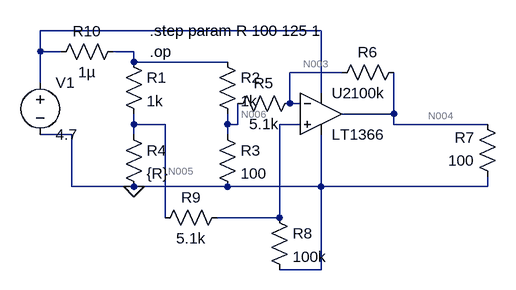
[diagram p0: schematic dorotki.asc]
dorotki.asc, the LTspice schematic file:
Version 4
SHEET 1 880 680
WIRE 368 48 -64 48
WIRE -64 80 -64 48
WIRE -32 80 -64 80
WIRE 80 80 48 80
WIRE 80 96 80 80
WIRE 224 96 80 96
WIRE 400 112 320 112
WIRE -64 128 -64 80
WIRE 368 144 368 48
WIRE 320 160 320 112
WIRE 336 160 320 160
WIRE 480 176 480 112
WIRE 480 176 400 176
WIRE 80 192 80 176
WIRE 128 192 80 192
WIRE 224 192 224 176
WIRE 240 192 240 160
WIRE 240 192 224 192
WIRE 336 192 304 192
WIRE 480 192 480 176
WIRE 624 192 480 192
WIRE -16 208 -64 208
WIRE 80 208 80 192
WIRE 224 208 224 192
WIRE -16 288 -16 208
WIRE 80 288 -16 288
WIRE 224 288 80 288
WIRE 368 288 368 208
WIRE 368 288 224 288
WIRE 624 288 624 272
WIRE 624 288 368 288
WIRE 128 336 128 192
WIRE 304 336 304 192
WIRE 304 336 208 336
WIRE 368 416 368 288
WIRE 368 416 304 416
FLAG 80 288 0
SYMBOL res 64 80 R0
SYMATTR InstName R1
SYMATTR Value 1k
SYMBOL res 208 80 R0
SYMATTR InstName R2
SYMATTR Value 1k
SYMBOL res 208 192 R0
SYMATTR InstName R3
SYMATTR Value 100
SYMBOL res 64 192 R0
SYMATTR InstName R4
SYMATTR Value {R}
SYMBOL voltage -64 112 R0
WINDOW 123 0 0 Left 2
WINDOW 39 0 0 Left 2
SYMATTR InstName V1
SYMATTR Value 4.7
SYMBOL res 336 144 R90
WINDOW 0 0 56 VBottom 2
WINDOW 3 32 56 VTop 2
SYMATTR InstName R5
SYMATTR Value 5.1k
SYMBOL res 496 96 R90
WINDOW 0 0 56 VBottom 2
WINDOW 3 32 56 VTop 2
SYMATTR InstName R6
SYMATTR Value 100k
SYMBOL res 640 288 R180
WINDOW 0 36 76 Left 2
WINDOW 3 36 40 Left 2
SYMATTR InstName R7
SYMATTR Value 100
SYMBOL res 288 320 R0
SYMATTR InstName R8
SYMATTR Value 100k
SYMBOL res 224 320 R90
WINDOW 0 0 56 VBottom 2
WINDOW 3 32 56 VTop 2
SYMATTR InstName R9
SYMATTR Value 5.1k
SYMBOL Opamps\\LT1366 368 112 R0
SYMATTR InstName U2
SYMBOL res 64 64 R90
WINDOW 0 0 56 VBottom 2
WINDOW 3 32 56 VTop 2
SYMATTR InstName R10
SYMATTR Value 1µ
TEXT 104 48 Left 2 !.step param R 100 125 1
TEXT 104 80 Left 2 !.op

The netlist it stands for:
* dorotki.asc
R1 N002 N005 1k
R2 N002 N006 1k
R3 N006 0 100
R4 N005 0 {R}
V1 N001 0 4.7
R5 N003 N006 5.1k
R6 N004 N003 100k
R7 0 N004 100
R8 N007 0 100k
R9 N007 N005 5.1k
XU2 N007 N003 N001 0 N004 LT1366  ; pins In+ In- V+ V- OUT
R10 N002 N001 1µ
.step param R 100 125 1
.op
.lib LTC.lib
.backanno
.end

* Results of the author's LTspice run, read from the files saved beside the schematic
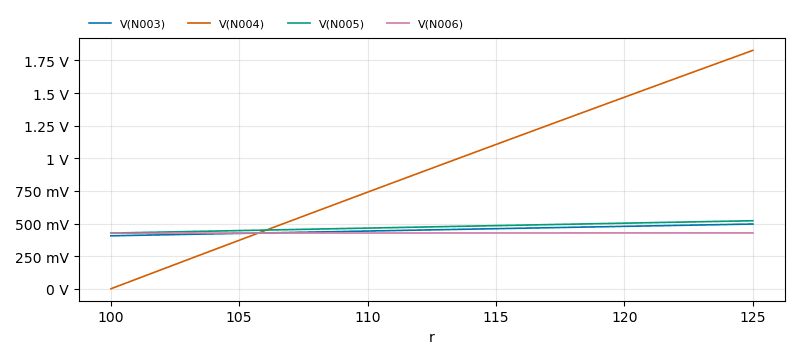
[diagram p1: Operating Point of dorotki.asc, plotted from the saved traces]
* Operating Point, 1 run:
*   V(N003): 406.2 mV at r=100 , 496.4 mV at r=125 , min 406.2 mV, max 496.4 mV
*   V(N004): 125.9 µV at r=100 , 1.827 V at r=125 , min 125.9 µV, max 1.827 V
*   V(N005): 426.9 mV at r=100 , 521.7 mV at r=125 , min 426.9 mV, max 521.7 mV
*   V(N006): 426.9 mV at r=100 , 428.5 mV at r=125 , min 426.9 mV, max 428.5 mV
* From the log:
*   Semiconductor Device Operating Points:
*                           --- Diodes ---
*   Name:    d:u2:9      d:u2:8      d:u2:10     d:u2:5      d:u2:4
*   Model:  u2:dbiasd   u2:dbiasd   u2:dbiasu   u2:dbiasu    u2:dlim
*   Id:     -1.96e-10   -1.96e-10    9.99e-09    9.99e-09    1.24e-10
*   Vd:     -1.94e+00   -1.94e+00    4.29e+00    4.29e+00    1.24e-01
*   Req:     1.00e-10    1.00e-10    1.00e-06    1.00e-06    1.00e-09
*   CAP:     0.00e+00    0.00e+00    0.00e+00    0.00e+00    0.00e+00
*   Name:    d:u2:3      d:u2:2      d:u2:7      d:u2:6      d:u2:1
*   Model:    u2:xd       u2:xu       u2:dp       u2:y        u2:y
*   Id:      1.88e-09   -6.20e-10    3.19e-04    2.88e-12   -2.88e-12
*   Vd:      1.44e+00   -6.14e+00    4.70e+00    1.44e+00   -1.44e+00
*   Req:     1.00e-03    1.00e-10    1.00e-02    1.00e-12    1.00e-12
*   CAP:     0.00e+00    0.00e+00    0.00e+00    0.00e+00    0.00e+00
*                           --- VDMOSFET Transistors ---
*   Name:        m:u2:2      m:u2:1
*   Model:        u2:p        u2:n
*   Id:         -2.81e-06    4.71e-12
*   Vgs:        -1.44e+00   -1.44e+00
*   Vds:        -1.26e-04    4.70e+00
*   Vth:         4.50e-02   -4.50e-02
*   Gm:          1.89e-06    0.00e+00
*   Gds:         2.23e-02    0.00e+00
*   Cgs:         0.00e+00    0.00e+00
*   Cgd:         0.00e+00    0.00e+00
*   Cbody:       0.00e+00    0.00e+00